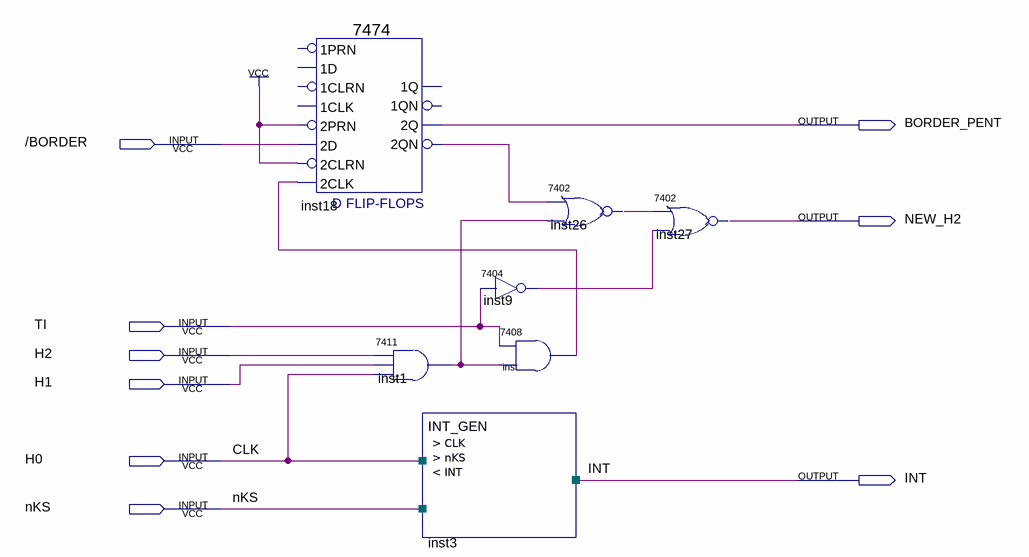
[diagram p0: schematic sheet]
// Quartus schematic l2p.bdf as structural Verilog: 7 symbols, 9 pins
module l2p (
  input  \/BORDER ,
  input  TI,
  input  H2,
  input  H1,
  input  H0,
  input  nKS,
  output BORDER_PENT,
  output NEW_H2,
  output INT
);

  wire inst1_1, inst9_1, inst18_2qn, inst26_1, inst_1;

  \7474  inst18 (
    .\2D (\/BORDER ), .\2PRN (1'b1), .\2CLK (inst_1), .\2CLRN (1'b1), .\2Q (BORDER_PENT), .\2QN (inst18_2qn));  // open: 1CLK, 1D, 1PRN, 1CLRN, 1QN, 1Q
  \7411  inst1 (.\2 (H2), .\3 (H1), .\4 (H0), .\1 (inst1_1));
  INT_GEN inst3 (.CLK(H0), .nKS(nKS), .INT(INT));
  \7404  inst9 (.\2 (TI), .\1 (inst9_1));
  \7408  inst (.\3 (inst1_1), .\2 (TI), .\1 (inst_1));
  \7402  inst26 (.\2 (inst18_2qn), .\3 (inst1_1), .\1 (inst26_1));
  \7402  inst27 (.\2 (inst26_1), .\3 (inst9_1), .\1 (NEW_H2));

  // Other names for the same wires on the sheet: CLK = H0
endmodule
